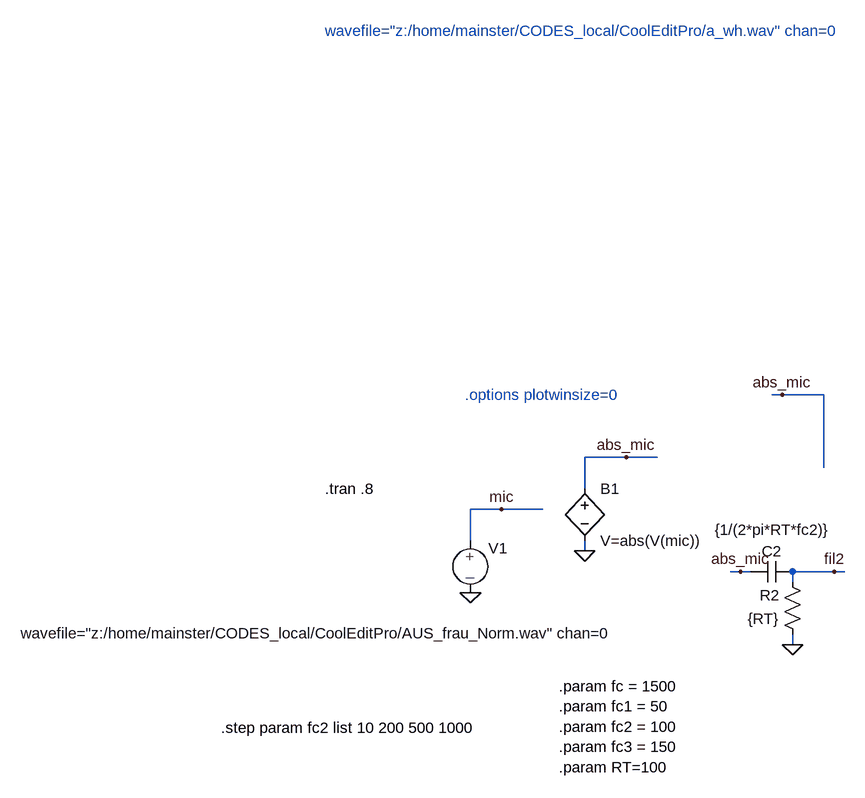
[diagram p0: schematic Draft1.asc]
Draft1.asc, the LTspice schematic file:
Version 4
SHEET 1 880 680
WIRE -32 -896 -48 -896
WIRE 32 -896 -32 -896
WIRE -272 -800 -336 -800
WIRE -224 -800 -272 -800
WIRE 32 -784 32 -896
WIRE -336 -752 -336 -800
WIRE -464 -720 -512 -720
WIRE -400 -720 -464 -720
WIRE -512 -672 -512 -720
WIRE -336 -656 -336 -672
WIRE -96 -624 -112 -624
WIRE -80 -624 -96 -624
WIRE 48 -624 -16 -624
WIRE 64 -624 48 -624
WIRE -16 -608 -16 -624
WIRE -16 -512 -16 -528
FLAG -512 -592 0
FLAG -464 -720 mic
FLAG -336 -656 0
FLAG -272 -800 abs_mic
FLAG -16 -512 0
FLAG 48 -624 fil2
FLAG -96 -624 abs_mic
FLAG -32 -896 abs_mic
SYMBOL source-V -512 -688 R0
WINDOW 3 -692 159 Left 2
SYMATTR Value wavefile="z:/home/mainster/CODES_local/CoolEditPro/AUS_frau_Norm.wav" chan=0
SYMATTR InstName V1
SYMBOL bv -336 -768 R0
SYMATTR InstName B1
SYMATTR Value V=abs(V(mic))
SYMBOL res 0 -512 R180
WINDOW 0 36 76 Left 2
WINDOW 3 36 40 Left 2
SYMATTR InstName R2
SYMATTR Value {RT}
SYMBOL cap -16 -640 R90
WINDOW 0 0 32 VBottom 2
WINDOW 3 -33 31 VBottom 2
SYMATTR InstName C2
SYMATTR Value {1/(2*pi*RT*fc2)}
TEXT -520 -896 Left 2 ;.options plotwinsize=0
TEXT -736 -1456 Left 2 ;wavefile="z:/home/mainster/CODES_local/CoolEditPro/a_wh.wav" chan=0
TEXT -376 -448 Left 2 !.param fc = 1500\n.param fc1 = 50\n.param fc2 = 100\n.param fc3 = 150\n.param RT=100
TEXT -736 -752 Left 2 !.tran .8
TEXT -896 -384 Left 2 !.step param fc2 list 10 200 500 1000

The netlist it stands for:
* Draft1.asc
V1 mic 0 wavefile="z:/home/mainster/CODES_local/CoolEditPro/AUS_frau_Norm.wav" chan=0
B1 abs_mic 0 V=abs(V(mic))
R2 0 fil2 {RT}
C2 fil2 abs_mic {1/(2*pi*RT*fc2)}
* .options plotwinsize=0
* wavefile="z:/home/mainster/CODES_local/CoolEditPro/a_wh.wav" chan=0
.param fc = 1500
.param fc1 = 50
.param fc2 = 100
.param fc3 = 150
.param RT=100
.tran .8
.step param fc2 list 10 200 500 1000
.backanno
.end